# EAGLE schematic Transmitter_ks0108_version (EAGLE 7.7.0)
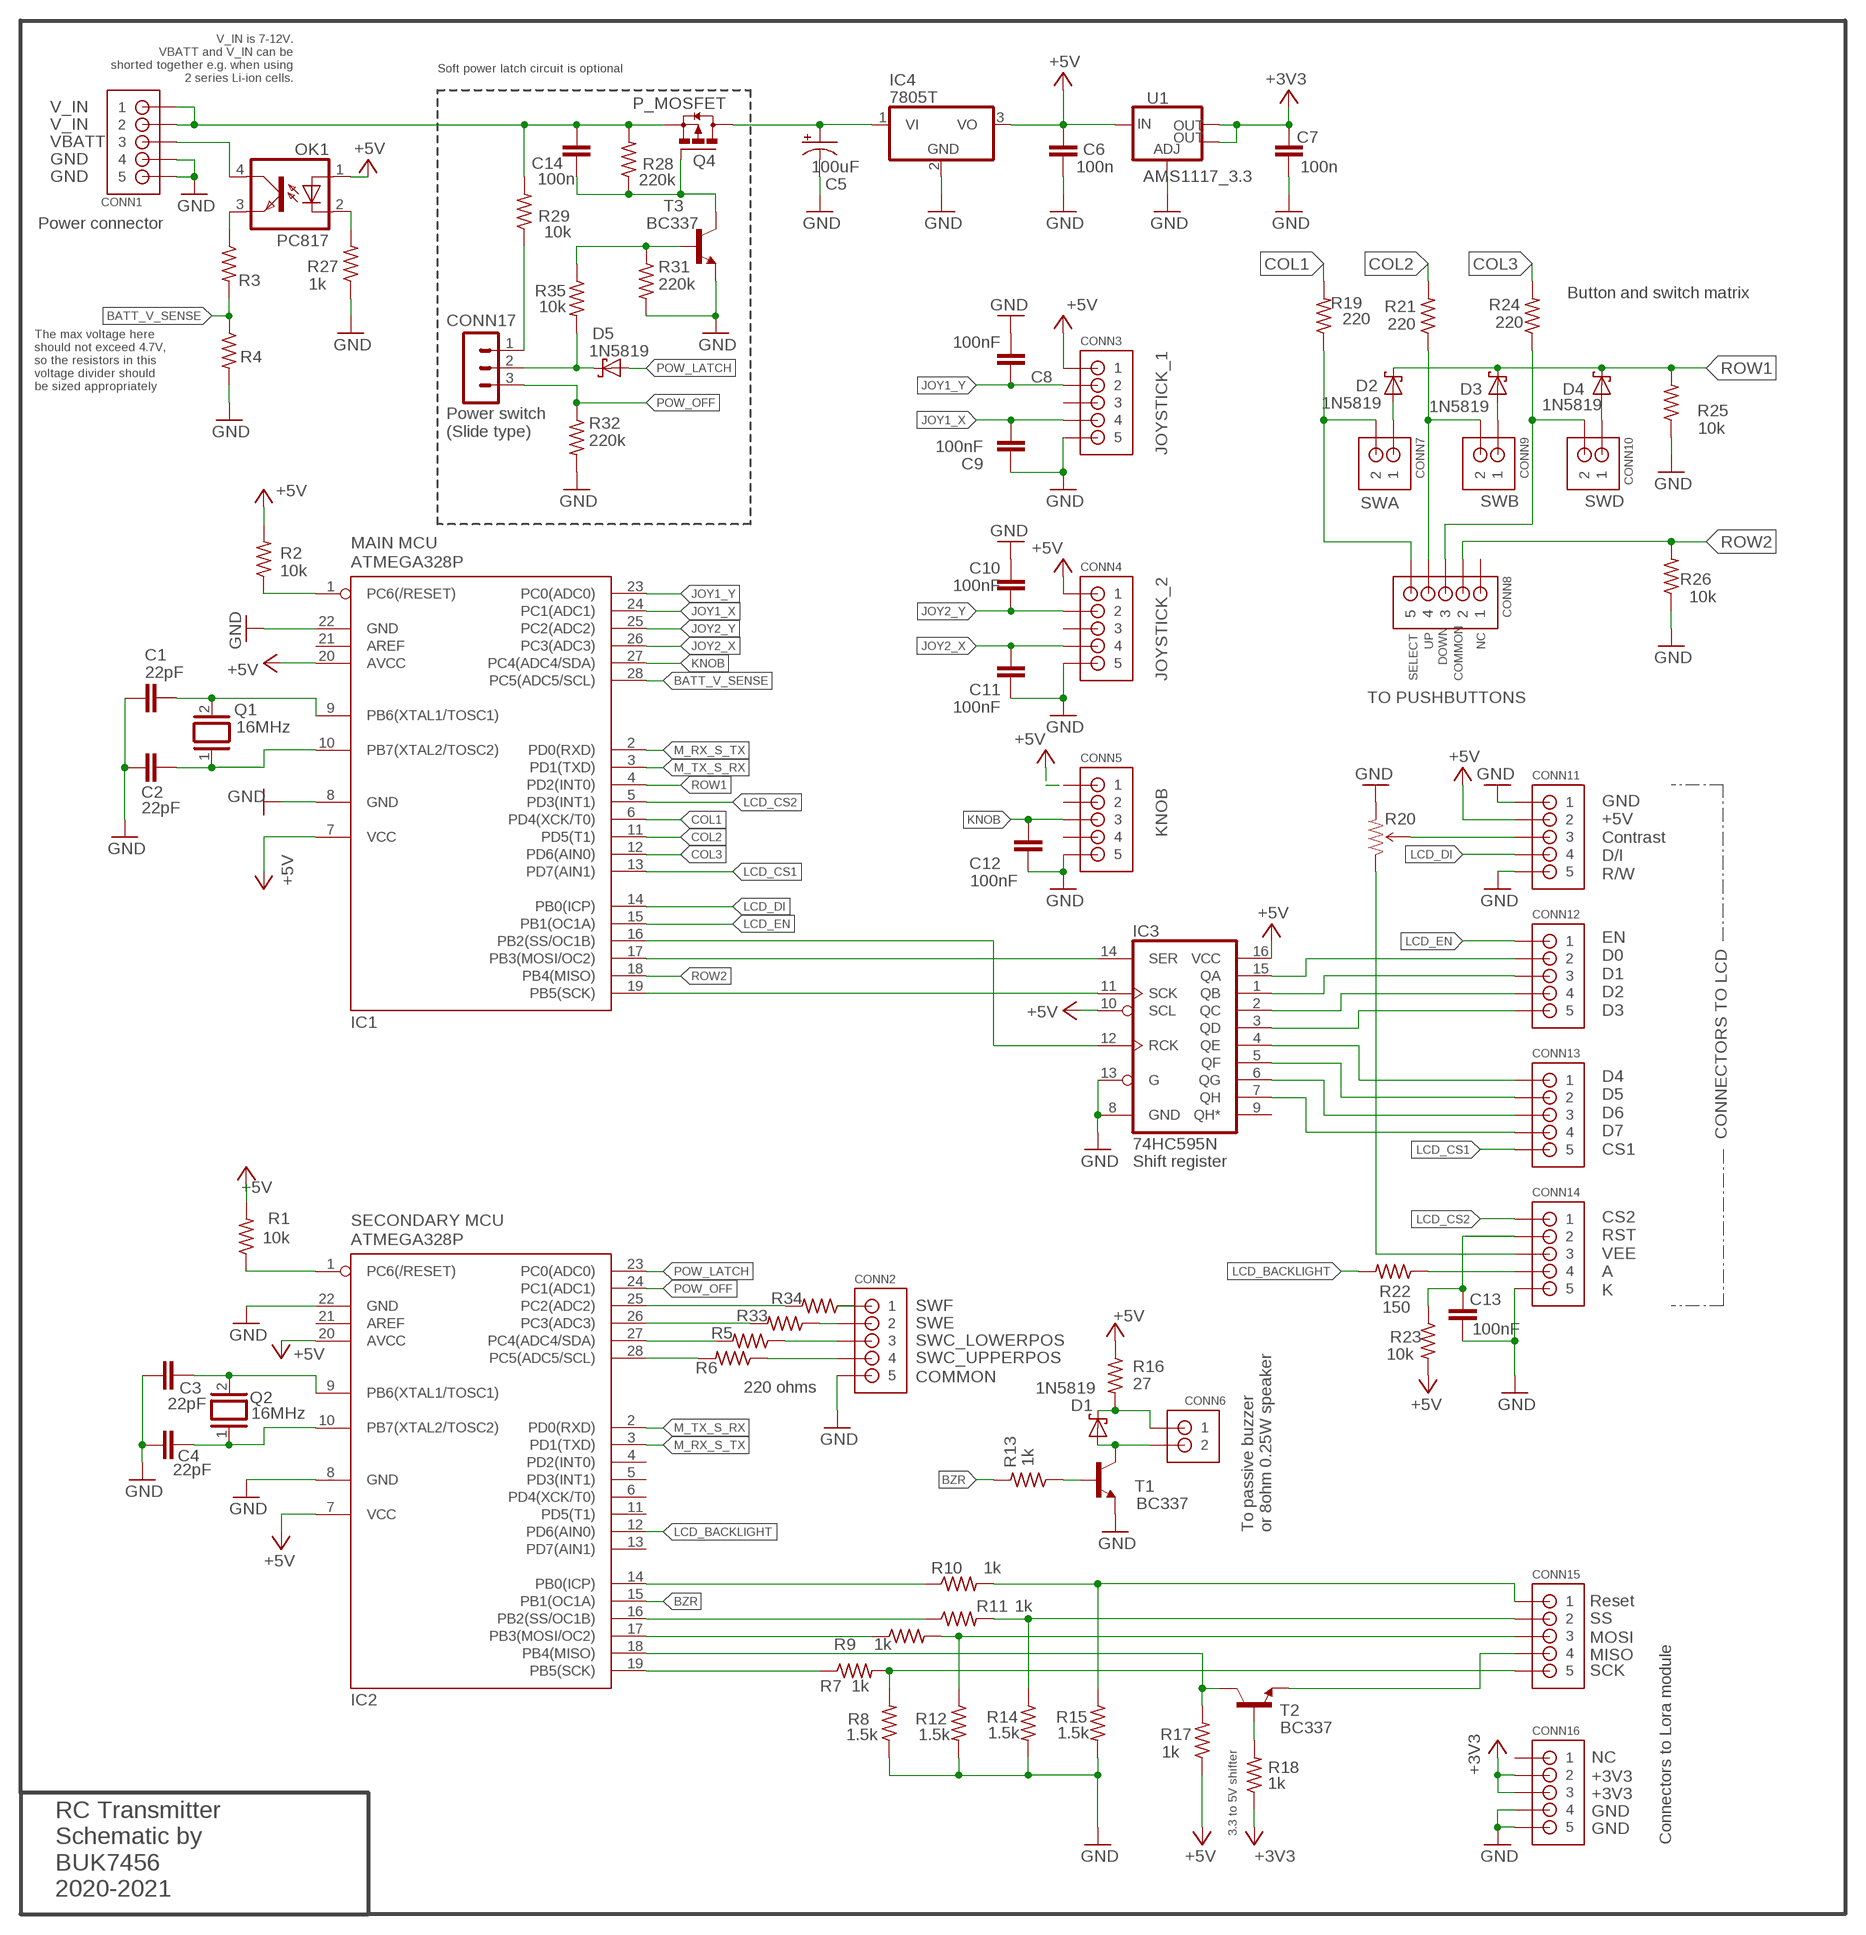
[diagram p0: schematic, sheet 1]

## Parts
C1  22pF  C-EU025-025X050  [C025-025X050]
C2  22pF  C-EU025-025X050  [C025-025X050]
C3  22pF  C-EU025-025X050  [C025-025X050]
C4  22pF  C-EU025-025X050  [C025-025X050]
C5  100uF  CPOL-USE2,5-6E  [E2,5-6E]
C6  100n  C-EU025-025X050  [C025-025X050]
C7  100n  C-EU025-025X050  [C025-025X050]
C8  100nF  C-EU025-025X050  [C025-025X050]
C9  100nF  C-EU025-025X050  [C025-025X050]
C10  100nF  C-EU025-025X050  [C025-025X050]
C11  100nF  C-EU025-025X050  [C025-025X050]
C12  100nF  C-EU025-025X050  [C025-025X050]
C13  100nF  C-EU025-025X050  [C025-025X050]
C14  100n  C-EU025-025X050  [C025-025X050]
CONN1  POW  JST-PH_5-PIN_HEADER  [JST_B5B-PH_HEADER]
CONN2  RADIO  JST-PH_5-PIN_HEADER  [JST_B5B-PH_HEADER]
CONN3  JST-PH_5-PIN_HEADER  [JST_B5B-PH_HEADER]
CONN4  JST-PH_5-PIN_HEADER  [JST_B5B-PH_HEADER]
CONN5  JST-PH_5-PIN_HEADER  [JST_B5B-PH_HEADER]
CONN6  JST-PH_2-PIN_HEADER  [JST_B2B-PH_HEADER]
CONN7  JST-PH_2-PIN_HEADER  [JST_B2B-PH_HEADER]
CONN8  JST-PH_5-PIN_HEADER  [JST_B5B-PH_HEADER]
CONN9  JST-PH_2-PIN_HEADER  [JST_B2B-PH_HEADER]
CONN10  JST-PH_2-PIN_HEADER  [JST_B2B-PH_HEADER]
CONN11  AUX  JST-PH_5-PIN_HEADER  [JST_B5B-PH_HEADER]
CONN12  AUX  JST-PH_5-PIN_HEADER  [JST_B5B-PH_HEADER]
CONN13  AUX  JST-PH_5-PIN_HEADER  [JST_B5B-PH_HEADER]
CONN14  AUX  JST-PH_5-PIN_HEADER  [JST_B5B-PH_HEADER]
CONN15  JST-PH_5-PIN_HEADER  [JST_B5B-PH_HEADER]
CONN16  JST-PH_5-PIN_HEADER  [JST_B5B-PH_HEADER]
CONN17  MA03-1  [MA03-1]
D1  1N5819  1N5817-B  [DO41-7.6]
D2  1N5819  1N5817-B  [DO41-7.6]
D3  1N5819  1N5817-B  [DO41-7.6]
D4  1N5819  1N5817-B  [DO41-7.6]
D5  1N5819  1N5817-B  [DO41-7.6]
IC1  ATMEGA328P  MEGA8-P  [DIL28-3]
IC2  ATMEGA328P  MEGA8-P  [DIL28-3]
IC3  74HC595N  74LS595N  [DIL16]
IC4  7805T  [TO220H]
OK1  PC817  [DIL04]
Q1  16MHz  XTAL/S  [QS]
Q2  16MHz  XTAL/S  [QS]
Q4  P_MOSFET  FDN360P  [SUPER-SOT3]
R1  10k  R-US_0204/5  [0204/5]
R2  10k  R-US_0207/10  [0207/10]
R3  1k  R-US_0207/10  [0207/10]
R4  1k  R-US_0204/2V  [0204V]
R5  220  R-US_0204/7  [0204/7]
R6  220  R-US_0204/7  [0204/7]
R7  1k  R-US_0204/5  [0204/5]
R8  1.5k  R-US_0204/2V  [0204V]
R9  1k  R-US_0204/5  [0204/5]
R10  1k  R-US_0204/5  [0204/5]
R11  1k  R-US_0204/5  [0204/5]
R12  1.5k  R-US_0204/2V  [0204V]
R13  1k  R-US_0204/5  [0204/5]
R14  1.5k  R-US_0204/2V  [0204V]
R15  1.5k  R-US_0204/2V  [0204V]
R16  27  R-US_0204/7  [0204/7]
R17  1k  R-US_0204/7  [0204/7]
R18  1k  R-US_0204/5  [0204/5]
R19  220  R-US_0204/7  [0204/7]
R20  TRIMPOTPTH  [TRIM_POT_PTH]
R21  220  R-US_0207/10  [0207/10]
R22  150  R-US_0204/2V  [0204V]
R23  10k  R-US_0204/5  [0204/5]
R24  220  R-US_0204/7  [0204/7]
R25  10k  R-US_0204/2V  [0204V]
R26  10k  R-US_0204/2V  [0204V]
R27  1k  R-US_0204/2V  [0204V]
R28  220k  R-US_0204/7  [0204/7]
R29  10k  R-US_0204/7  [0204/7]
R31  220k  R-US_0204/7  [0204/7]
R32  220k  R-US_0204/7  [0204/7]
R33  220  R-US_0204/7  [0204/7]
R34  220  R-US_0204/7  [0204/7]
R35  10k  R-US_0204/7  [0204/7]
T1  BC337  [TO92]
T2  BC337  [TO92]
T3  BC337  [TO92]
U1  AMS1117_3.3  V_REG_LM1117SOT223  [SOT223]

## Nets
+3V3: C7.2 CONN16.P2 CONN16.P3 R18.1 U1.2(OUT) U1.4(OUT)
+5V: C6.2 CONN3.P1 CONN4.P1 CONN5.P1 CONN11.P2 IC1.7(VCC) IC1.20(AVCC) IC2.7(VCC) IC2.20(AVCC) IC3.10(SCL) IC3.16(VCC) IC4.3(VO) OK1.1(A) R1.2 R2.2 R16.1 R17.1 R23.2 U1.3(IN)
BATT_V_SENSE: IC1.28(PC5(ADC5/SCL)) R3.2 R4.1
BZR: IC2.15(PB1(OC1A)) R13.2
COL1: IC1.6(PD4(XCK/T0)) R19.2
COL2: IC1.11(PD5(T1)) R21.2
COL3: IC1.12(PD6(AIN0)) R24.2
GND: C1.1 C2.1 C3.1 C4.1 C5.- C6.1 C7.1 C8.2 C9.1 C10.2 C11.1 C12.1 C13.2 CONN1.P4 CONN1.P5 CONN2.P5 CONN3.P5 CONN4.P5 CONN5.P5 CONN11.P1 CONN11.P5 CONN14.P5 CONN16.P4 CONN16.P5 IC1.8(GND) IC1.22(GND) IC2.8(GND) IC2.22(GND) IC3.8(GND) IC3.13(G) IC4.2(GND) R4.2 R8.1 R12.2 R14.2 R15.2 R20.3(CW) R25.1 R26.1 R27.1 R31.2 R32.2 T1.1(E) T3.1(E) U1.1(ADJ)
JOY1_X: C9.2 CONN3.P4 IC1.24(PC1(ADC1))
JOY1_Y: C8.1 CONN3.P2 IC1.23(PC0(ADC0))
JOY2_X: C11.2 CONN4.P4 IC1.26(PC3(ADC3))
JOY2_Y: C10.1 CONN4.P2 IC1.25(PC2(ADC2))
KNOB: C12.2 CONN5.P3 IC1.27(PC4(ADC4/SDA))
LCD_BACKLIGHT: IC2.12(PD6(AIN0)) R22.2
LCD_CS1: CONN13.P5 IC1.13(PD7(AIN1))
LCD_CS2: CONN14.P1 IC1.5(PD3(INT1))
LCD_DI: CONN11.P4 IC1.14(PB0(ICP))
LCD_EN: CONN12.P1 IC1.15(PB1(OC1A))
LCD_RST1: C13.1 CONN14.P2 R23.1
M_RX_S_TX: IC1.2(PD0(RXD)) IC2.3(PD1(TXD))
M_TX_S_RX: IC1.3(PD1(TXD)) IC2.2(PD0(RXD))
MASTER_RST: IC1.1(PC6(/RESET)) R2.1
MASTER_RST1: IC2.1(PC6(/RESET)) R1.1
MISO: IC2.18(PB4(MISO)) R17.2 T2.3(C)
N$1: CONN1.P3 OK1.4(COL)
N$2: CONN12.P2 IC3.15(QA)
N$3: CONN12.P3 IC3.1(QB)
N$4: CONN12.P4 IC3.2(QC)
N$5: CONN12.P5 IC3.3(QD)
N$6: CONN13.P1 IC3.4(QE)
N$7: CONN13.P2 IC3.5(QF)
N$8: CONN13.P3 IC3.6(QG)
N$9: C1.2 IC1.9(PB6(XTAL1/TOSC1)) Q1.2
N$10: C2.2 IC1.10(PB7(XTAL2/TOSC2)) Q1.1
N$11: IC1.19(PB5(SCK)) IC3.11(SCK)
N$12: CONN14.P4 R22.1
N$13: IC1.17(PB3(MOSI/OC2)) IC3.14(SER)
N$14: IC1.16(PB2(SS/OC1B)) IC3.12(RCK)
N$15: IC2.28(PC5(ADC5/SCL)) R6.2
N$16: C3.2 IC2.9(PB6(XTAL1/TOSC1)) Q2.2
N$17: C4.2 IC2.10(PB7(XTAL2/TOSC2)) Q2.1
N$18: CONN7.P2 CONN8.P5 R19.1
N$19: CONN8.P4 CONN9.P2 R21.1
N$20: CONN8.P3 CONN10.P2 R24.1
N$21: CONN7.P1 D2.A
N$22: CONN9.P1 D3.A
N$23: CONN10.P1 D4.A
N$24: IC2.14(PB0(ICP)) R10.1
N$25: CONN13.P4 IC3.7(QH)
N$26: IC2.27(PC4(ADC4/SDA)) R5.2
N$27: CONN2.P3 R5.1
N$28: CONN15.P4 T2.1(E)
N$29: CONN2.P4 R6.1
N$30: IC2.16(PB2(SS/OC1B)) R11.1
N$31: R13.1 T1.2(B)
N$32: CONN6.P2 D1.A T1.3(C)
N$33: CONN6.P1 D1.C R16.2
N$34: CONN15.P2 R11.2 R14.1
N$35: IC2.17(PB3(MOSI/OC2)) R9.1
N$36: R18.2 T2.2(B)
N$37: CONN15.P1 R10.2 R15.1
N$38: OK1.3(EMIT) R3.1
N$39: C14.2 CONN1.P1 CONN1.P2 Q4.2(S) R28.2 R29.2
N$40: CONN15.P3 R9.2 R12.1
N$41: IC2.19(PB5(SCK)) R7.1
N$42: CONN15.P5 R7.2 R8.2
N$43: C14.1 Q4.1(G) R28.1 T3.3(C)
N$44: OK1.2(C) R27.2
N$45: CONN17.1 R29.1
N$46: CONN11.P3 R20.2(WIPER)
N$47: C5.+ IC4.1(VI) Q4.3(D)
N$48: CONN14.P3 R20.1(CCW)
N$49: CONN2.P2 R33.1
N$50: CONN2.P1 R34.1
N$51: IC2.26(PC3(ADC3)) R33.2
N$52: IC2.25(PC2(ADC2)) R34.2
N$53: R31.1 R35.1 T3.2(B)
N$54: CONN17.2 D5.C R35.2
POW_LATCH: D5.A IC2.23(PC0(ADC0))
POW_OFF: CONN17.3 IC2.24(PC1(ADC1)) R32.1
ROW1: D2.C D3.C D4.C IC1.4(PD2(INT0)) R25.2
ROW2: CONN8.P2 IC1.18(PB4(MISO)) R26.2
Unconnected: CONN3.P3 CONN4.P3 CONN5.P2 CONN5.P4 CONN8.P1 CONN16.P1 IC1.21(AREF) IC2.4(PD2(INT0)) IC2.5(PD3(INT1)) IC2.6(PD4(XCK/T0)) IC2.11(PD5(T1)) IC2.13(PD7(AIN1)) IC2.21(AREF) IC3.9(QH*)

## Notes on the sheet
- V_IN is 7-12V.
  VBATT and V_IN can be
  shorted together e.g. when using
  2 series Li-ion cells.
- Soft power latch circuit is optional
- V_IN
- V_IN
- VBATT
- GND
- GND
- Power connector
- Button and switch matrix
- The max voltage here
  should not exceed 4.7V,
  so the resistors in this
  voltage divider should
  be sized appropriately
- Power switch
  (Slide type)
- JOYSTICK_1
- SWA | SWB | SWD
- MAIN MCU
- UP | NC
- DOWN
- JOYSTICK_2 | SELECT | COMMON
- TO PUSHBUTTONS
- KNOB
- GND
  +5V
  Contrast
  D/I
  R/W
- EN
  D0
  D1
  D2
  D3
- CONNECTORS TO LCD
- D4
  D5
  D6
  D7
  CS1
- Shift register
- SECONDARY MCU
- CS2
  RST
  VEE
  A
  K
- SWF
- SWE
- SWC_LOWERPOS
- SWC_UPPERPOS
- 220 ohms | COMMON
- To passive buzzer
  or 8ohm 0.25W speaker
- Reset
- SS
- MOSI
- MISO
- SCK
- NC
- +3V3
- +3V3
- GND
- 3.3 to 5V shifter | GND
- Connectors to Lora module
- RC Transmitter
  Schematic by
  BUK7456
  2020-2021

## Library data of the parts
C1-C4 C6-C14 = rcl:C-EU: CAPACITOR, European symbol
C5 = rcl:CPOL-US: POLARIZED CAPACITOR, American symbol
CONN1-CONN5 CONN8 CONN11-CONN16 = SRGmod:JST-PH_5-PIN_HEADER: 5-pin JST PH Shrouded Header, top entry P/N B5B-PH-K-S Mating connector PHR-5 Mating cable assembly: Sparkfun PRT-09917 <http://www.sparkfun.com/products/9917>
CONN6 CONN7 CONN9 CONN10 = SRGmod:JST-PH_2-PIN_HEADER: 2-pin JST PH Shrouded Header, top entry P/N B2B-PH-K-S Mating connector PHR-2 Mating cable assembly: Sparkfun PRT-09914 <http://www.sparkfun.com/products/9914>
CONN17 = con-lstb:MA03-1: PIN HEADER; OC_FARNELL: unknown; OC_NEWARK: unknown
D1-D5 = diode:1N581*: 1.0A SCHOTTKY BARRIER RECTIFIER Source: http://www.diodes.com/datasheets/ds23001.pdf
IC1 IC2 = atmel:MEGA8-P: MICROCONTROLLER 8 Kbytes FLASH, 1 kbytes SRAM, 512 bytes EEPROM, USART, 4-channel 10 bit ADC, 2-channel 8 bit ADC Pin compatible with Atmega48, ATMega88, ATMega168 Source: avr.lbr; OC_FARNELL: unknown; OC_NEWARK: unknown
IC3 = SparkFun-DigitalIC:74*595: 8-bit SHIFT REGISTER, output latch
IC4 = linear:78*: Positive VOLTAGE REGULATOR Source: http://cache.national.com/ds/LM/LM78L05.pdf http://www.fairchildsemi.com/ds/LM/LM7805.pdf
OK1 = optocoupler:PC817: SHARP OPTO COUPLER; MPN: PC817X4J000F; OC_FARNELL: 9707727; OC_NEWARK: 97K7059
Q1 Q2 = special:XTAL/S: CRYSTAL
Q4 = transistor-power:FDN360P: Single P-Channel, PowerTrench (R) MOSFET Source: http://www.fairchildsemi.com/ds/FD/FDN360P.pdf
R1-R3 R5-R19 R21 R22 R24-R29 R31-R35 = rcl:R-US_: RESISTOR, American symbol
R4 R23 = resistor:R-US_: RESISTOR, American symbol
R20 = SparkFun-Electromechanical:TRIMPOT: Various small potentiometers for "set-and-forget" applications
T1-T3 = transistor:BC337: NPN TRANSISTOR
U1 = SparkFun-PowerIC:V_REG_LM1117: Voltage Regulator LM1117 Standard adjustable voltage regulator but in SMD form. Spark Fun Electronics SKU : COM-00595; PROD_ID: VREG-08170